# EasyEDA Pro project stm32h7手持mp3.eprj, board PCB1
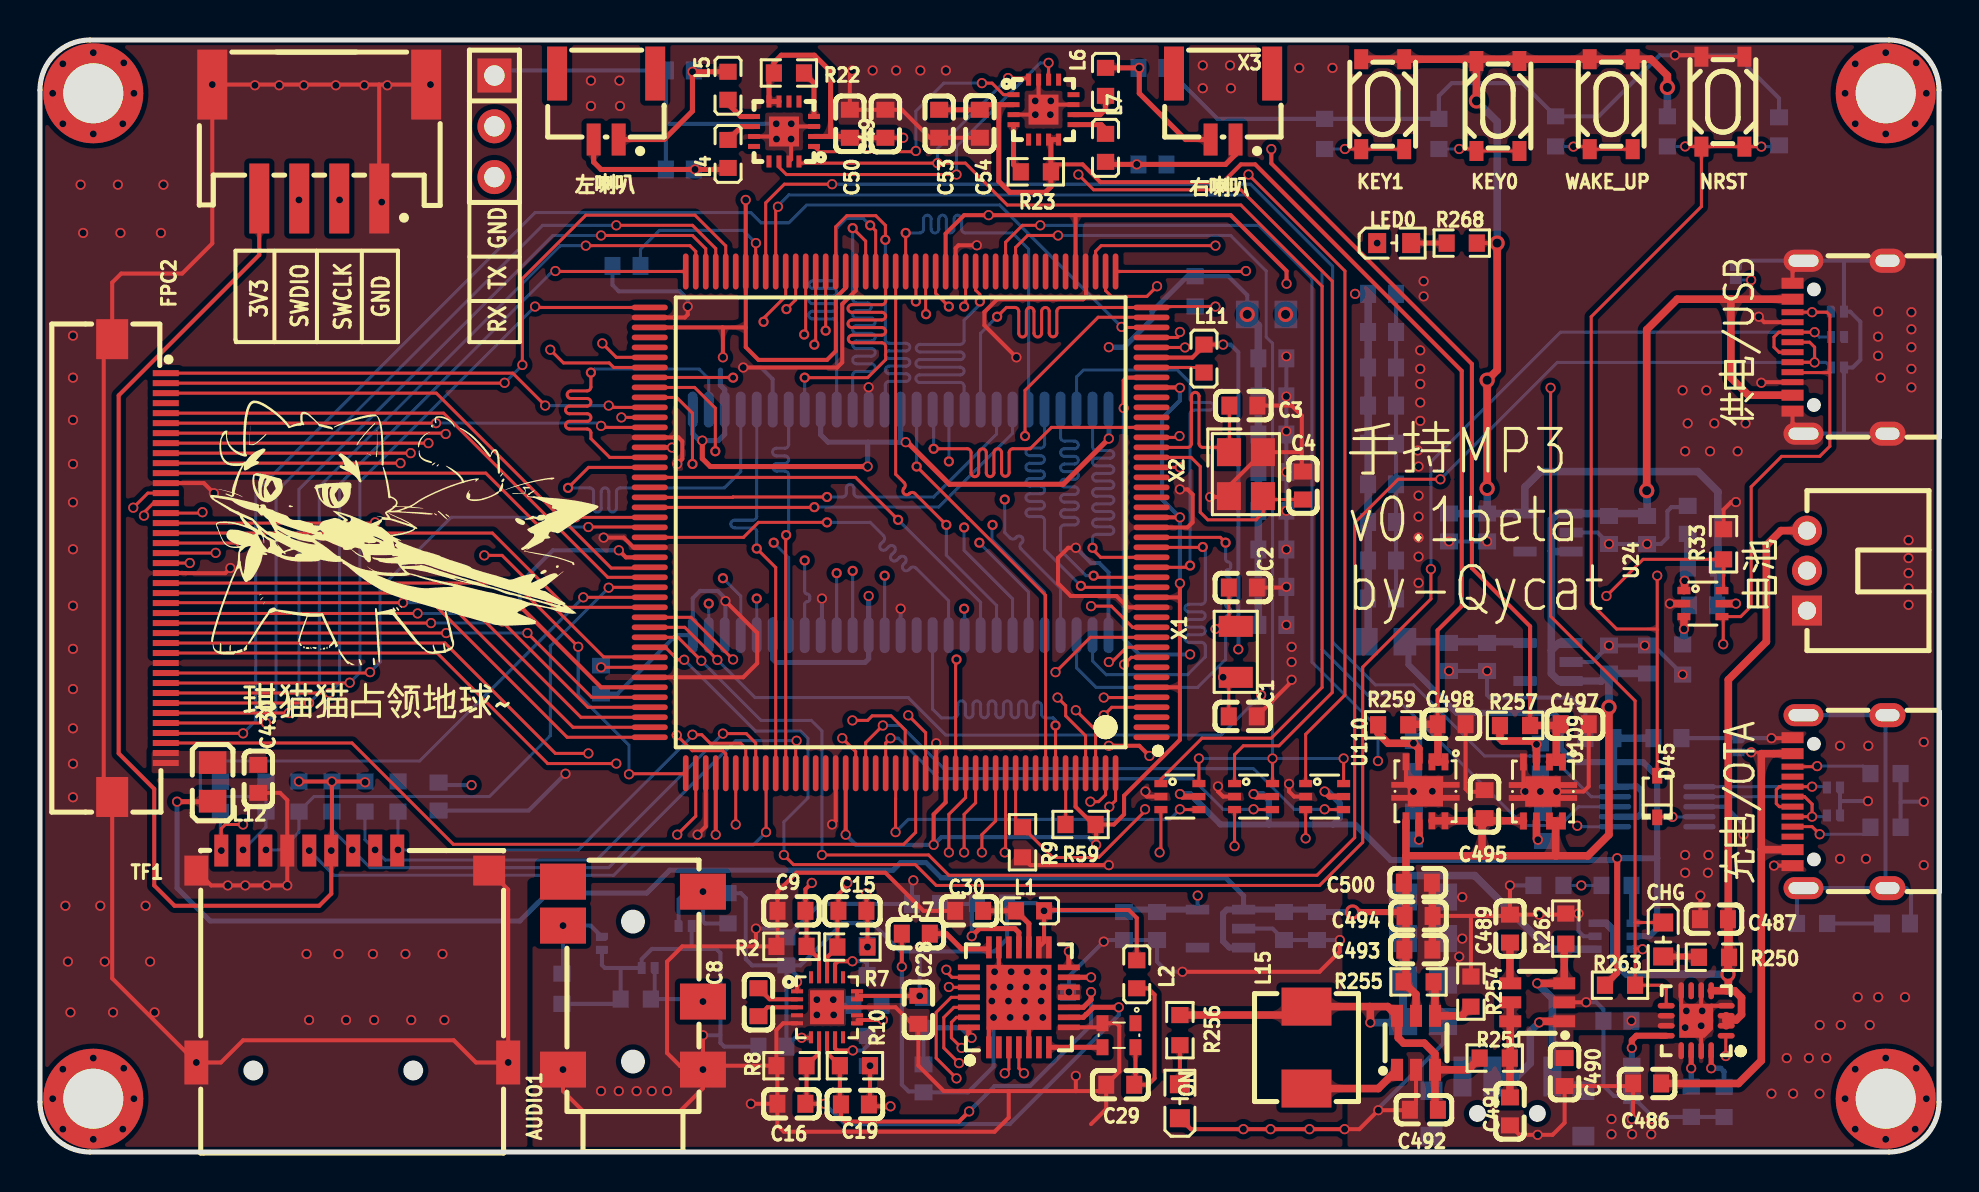
[diagram p2: board, top side]
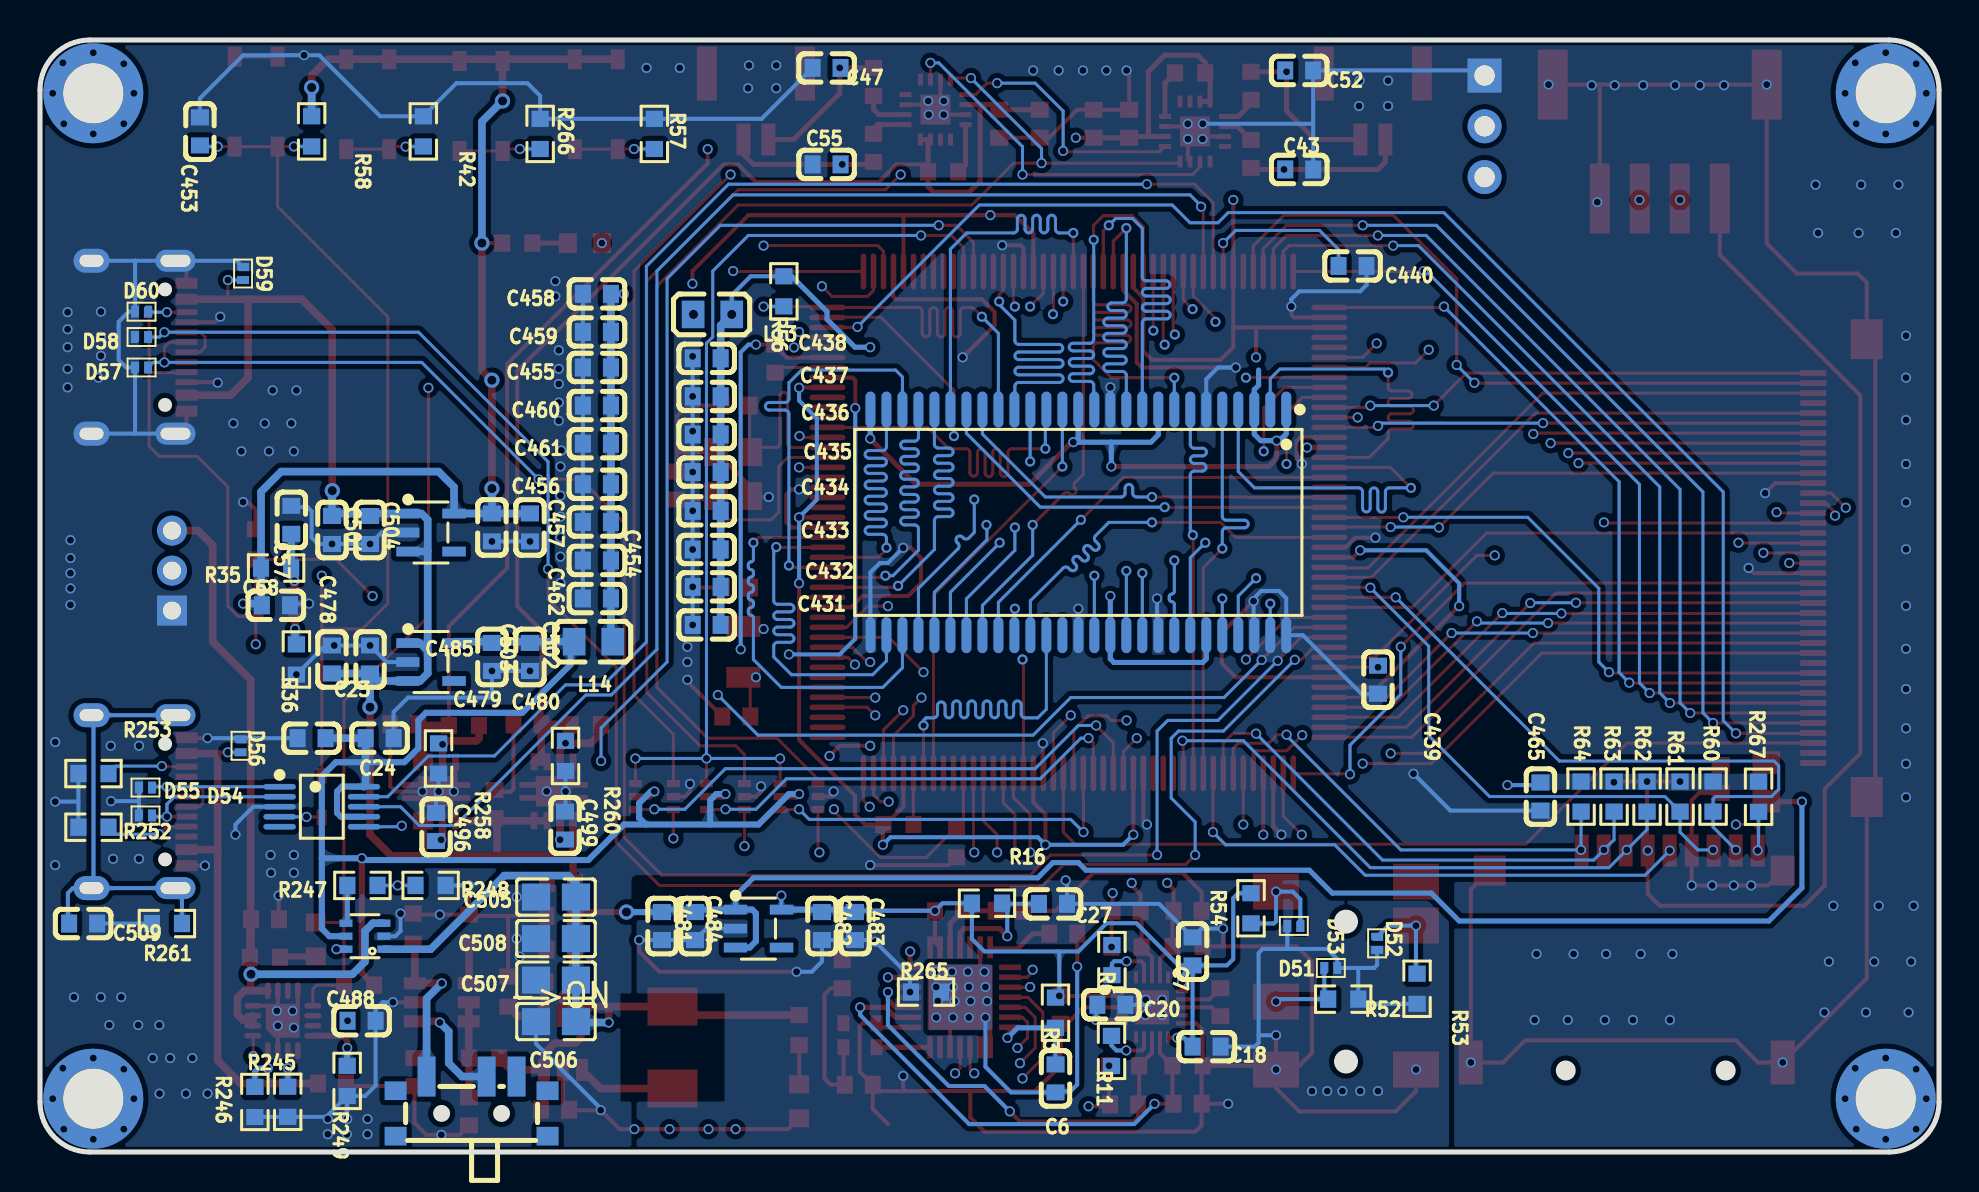
[diagram p3: board, bottom side, seen from below]

Outline 95 x 55.63 mm; copper layers: Top Layer, Inner1, Inner2, Bottom Layer. Coordinates in mm from the lower left corner of the outline.
Outline path: 0,53.13 0,2.5 arc(0.73,0.73) 2.5,0 92.5,0 arc(94.26,0.73) 95,2.5 95,53.13 arc(94.26,54.89) 92.5,55.63 2.5,55.63 arc(0.73,54.89) 0,53.13
Stack: Top Layer 0.035mm 外层铜厚1oz / Dielectric1 0.2104mm 7628 RC49% 8.6mil / Inner1 0.0152mm 内层铜厚 / Dielectric2 1.065mm 1.1mm H/HOZ Copper / Inner2 0.0152mm 内层铜厚 / Dielectric3 0.2104mm 7628 RC49% 8.6mil / Bottom Layer 0.035mm 外层铜厚1oz

## Design rules (mm)
net LCD_RST: LCD
net CTP_INT: LCD
net CTP_SCL: LCD
net LCD_R0: LCD
net LCD_R1: LCD
net LCD_R2: LCD
net LCD_R3: LCD
net LCD_R4: LCD
net LCD_R5: LCD
net LCD_R6: LCD
net LCD_R7: LCD
net LCD_G0: LCD
net LCD_G1: LCD
net LCD_G2: LCD
net LCD_G3: LCD
net LCD_G4: LCD
net LCD_G5: LCD
net LCD_G6: LCD
net LCD_G7: LCD
net LCD_B0: LCD
net LCD_B1: LCD
net LCD_B2: LCD
net LCD_B3: LCD
net LCD_B4: LCD
net LCD_B5: LCD
net LCD_B6: LCD
net LCD_B7: LCD
net LCD_PCLK: LCD
net LCD_HSYNC: LCD
net LCD_VSYNC: LCD
net LCD_DEN: LCD
net BL_CTR: LCD
net RTP_MISO: LCD
net CTP_RST: LCD
net CTP_SDA: LCD
template: 自定义配置
spacing copperThickness1oz (default): track to track 0.102, other pairs 0.152 to 0.3
spacing copperThickness2oz: track to track 0.203, other pairs 0.152 to 0.3
track width copperThickness1oz (default): min 0.127, default 0.254, max 2.54
track width copperThickness2oz: min 0.203, default 0.254, max 2.54
differential pair differentialPair (default): width min 0.127, default 0.254, max 2.54; gap min 0.152, default 0.152
via viaSize (default): diameter min 0.5, default 0.61, max 10; hole min 0.3, default 0.305, max 6.3

## Placement (name value [footprint] x y rotation side)
->ON  MK-12C02-G020  [SW-SMD_MK-12C02-G020]  73.41 2.29 180 bottom
AUDIO1  PJ-3420-A-SMT  [AUDIO-SMD_PJ-3420-A-SMT_C319102]  29.66 8.83 90 top
C1  6pF  [C0603]  60.17 21.79 180 top
C2  6pF  [C0603]  60.17 28.24 180 top
C3  22pF  [C0603]  60.2 37.34 0 top
C4  22pF  [C0603]  63.18 33.34 90 top
C6  1uF  [C0603]  44.2 3.68 90 bottom
C7  100nF  [C0603]  37.34 10.04 90 bottom
C8  4.7uF  [C0603]  35.94 7.49 270 top
C9  2.2nF  [C0603]  37.59 12.06 180 top
C15  2.2nF  [C0603]  40.64 12.06 180 top
C16  2.2nF  [C0603]  37.59 2.41 0 top
C17  2.2uF  [C0603]  43.81 10.92 0 top
C18  100nF  [C0603]  36.64 5.27 0 bottom
C19  2.2nF  [C0603]  40.77 2.38 0 top
C20  22uF  [C0603]  41.4 7.37 180 bottom
C23  0.1uF  [C0603]  81.41 20.7 0 bottom
C24  0.1uF  [C0603]  78.01 20.7 180 bottom
C27  100nF  [C0603]  44.32 12.41 0 bottom
C28  100nF  [C0603]  43.94 7.11 90 top
C29  100nF  [C0603]  54.04 3.37 180 top
C30  100nF  [C0603]  46.48 12.06 0 top
C43  680pF  [C0603]  32 49.15 180 bottom
C47  680pF  [C0603]  55.65 54.23 0 bottom
C49  10uF  [C0603]  40.51 51.43 270 top
C50  100nF  [C0603]  42.29 51.43 90 top
C52  680pF  [C0603]  32.01 54.1 0 bottom
C53  10uF  [C0603]  44.98 51.43 90 top
C54  100nF  [C0603]  47.01 51.43 270 top
C55  680pF  [C0603]  55.65 49.4 180 bottom
C57  100nF  [C0603]  82.42 31.62 90 bottom
C68  100nF  [C0603]  83.2 27.35 0 bottom
C430  100nF  [C0603]  10.92 18.67 270 top
C431  100nF  [C0603]  61.65 26.37 0 bottom
C432  100nF  [C0603]  61.65 28.27 0 bottom
C433  100nF  [C0603]  61.65 30.14 0 bottom
C434  100nF  [C0603]  61.65 32.07 0 bottom
C435  100nF  [C0603]  61.65 34.01 0 bottom
C436  100nF  [C0603]  61.65 35.89 0 bottom
C437  100nF  [C0603]  61.65 37.8 0 bottom
C438  100nF  [C0603]  61.65 39.7 0 bottom
C439  2.2uF  [C0603]  28.06 23.63 90 bottom
C440  2.2uF  [C0603]  29.34 44.32 0 bottom
C453  100nF  [C0603]  87 51.05 90 bottom
C454  100nF  [C0603]  67.14 29.59 180 bottom
C455  100nF  [C0603]  67.14 39.24 180 bottom
C456  100nF  [C0603]  67.14 33.4 180 bottom
C457  100nF  [C0603]  67.14 31.51 180 bottom
C458  100nF  [C0603]  67.14 42.93 180 bottom
C459  100nF  [C0603]  67.14 41.02 180 bottom
C460  100nF  [C0603]  67.14 37.34 180 bottom
C461  100nF  [C0603]  67.14 35.43 180 bottom
C462  10uF  [C0603]  67.14 27.69 180 bottom
C465  100nF  [C0603]  19.94 17.78 270 bottom
C478  100nF  [C0603]  80.39 24.64 270 bottom
C479  100nF  [C0603]  72.39 24.76 90 bottom
C480  10uF  [C0603]  70.48 24.76 90 bottom
C481  100nF  [C0603]  63.88 11.3 90 bottom
C482  100nF  [C0603]  55.88 11.3 90 bottom
C483  10uF  [C0603]  54.23 11.3 90 bottom
C484  10uF  [C0603]  62.23 11.3 90 bottom
C485  10uF  [C0603]  78.49 24.64 270 bottom
C486  1uF  [C0603]  80.39 3.43 180 top
C487  4.7uF  [C0603]  83.74 11.65 0 top
C488  4.7uF  [C0603]  78.91 6.57 0 bottom
C489  1nF  [C0603]  73.53 11.18 270 top
C490  1uF  [C0603]  76.27 4 90 top
C491  100nF  [C0603]  73.53 2.03 270 top
C492  22uF  [C0603]  69.23 2.11 180 top
C493  22uF  [C0603]  68.95 10.12 0 top
C494  22uF  [C0603]  68.96 11.81 0 top
C495  1uF  [C0603]  72.26 17.4 90 top
C496  10nF  [C0603]  75.18 16.26 270 bottom
C497  4.7uF  [C0603]  76.77 21.4 180 top
C498  4.7uF  [C0603]  70.61 21.4 180 top
C499  10nF  [C0603]  68.73 16.33 270 bottom
C500  1uF  [C0603]  68.93 13.47 0 top
C501  100nF  [C0603]  80.39 31.11 90 bottom
C502  100nF  [C0603]  70.48 31.24 90 bottom
C503  10uF  [C0603]  72.39 31.24 90 bottom
C504  10uF  [C0603]  78.49 31.11 90 bottom
C505  22uF  [C0805]  69.18 12.75 180 bottom
C506  22uF  [C0805]  69.18 6.52 180 bottom
C507  22uF  [C0805]  69.18 8.6 180 bottom
C508  22uF  [C0805]  69.18 10.68 180 bottom
C509  4.7nF  [C0603]  92.84 11.43 0 bottom
CHG  GL0603UR01  [LED0603-FD]  81.2 10.63 90 top
D45  1N4148WS  [SOD-323_L1.7-W1.3-LS2.5-FD]  80.9 17.78 270 top
D51  ASB05LCDF  [DFN-2L_L1.0-W0.6-P0.65-BI]  30.43 9.21 180 bottom
D52  ASB05LCDF  [DFN-2L_L1.0-W0.6-P0.65-BI]  28.11 10.44 270 bottom
D53  ASB05LCDF  [DFN-2L_L1.0-W0.6-P0.65-BI]  32.27 11.31 0 bottom
D54  ASB05LCDF  [DFN-2L_L1.0-W0.6-P0.65-BI]  89.72 16.83 180 bottom
D55  ASB05LCDF  [DFN-2L_L1.0-W0.6-P0.65-BI]  89.72 18.23 180 bottom
D56  AZ5825-01F  [DFN-2L_L1.0-W0.6-P0.65-BI]  84.96 20.32 270 bottom
D57  ASB05LCDF  [DFN-2L_L1.0-W0.6-P0.65-BI]  89.92 39.24 180 bottom
D58  ASB05LCDF  [DFN-2L_L1.0-W0.6-P0.65-BI]  89.92 40.77 180 bottom
D59  AZ5825-01F  [DFN-2L_L1.0-W0.6-P0.65-BI]  84.84 43.94 270 bottom
D60  AZ5825-01F  [DFN-2L_L1.0-W0.6-P0.65-BI]  89.92 42.04 0 bottom
FPC2  AFC01-S40FCA-00  [FPC-SMD_AFC01-S40FCA-00]  4.95 29.21 270 top
H1  PZ254V-11-03P  [HDR-TH_3P-P2.54-V-M_PZ254V-11-03P]  22.73 51.31 270 top
KEY0  TS3425BA  [SW-SMD_4P-L4.2-W3.2-P2.15-LS4.6-1]  72.93 52.32 270 top
KEY1  TS3425BA  [SW-SMD_4P-L4.2-W3.2-P2.15-LS4.6-1]  67.17 52.41 270 top
L1  BLM18EG221SN1D  [L0603]  49.53 12.06 0 top
L2  BLM18EG221SN1D  [L0603]  54.86 8.89 90 top
L4  BLM18EG221SN1D  [L0603]  34.42 49.93 270 top
L5  BLM18EG221SN1D  [L0603]  34.42 53.34 90 top
L6  BLM18EG221SN1D  [L0603]  53.3 53.53 90 top
L7  BLM18EG221SN1D  [L0603]  53.3 50.23 270 top
L11  BLM18SG221TN1D  [L0603]  58.23 39.69 90 top
L12  BLM21PG331SN1D  [L0805]  8.64 18.51 90 top
L13  BLM21PG331SN1D  [L0805]  61.36 41.9 180 bottom
L14  BLM21PG331SN1D  [L0805]  67.31 25.53 180 bottom
L15  2.2uH  [IND-SMD_L5.4-W5.2_FXL0530]  63.36 5.22 90 top
LED0  GL0603UR01  [LED0603-FD]  67.74 45.47 180 top
NOREF  -  [Pad_e93]  92.33 52.96 0 top
NOREF#2  -  [Pad_e116]  2.67 2.67 0 top
NOREF#3  -  [Pad_e69]  2.67 52.96 0 top
NOREF#4  -  [Pad_e106]  92.33 2.67 0 top
NRST  TS3425BA  [SW-SMD_4P-L4.2-W3.2-P2.15-LS4.6-1]  84.19 52.54 90 top
ON  GL0603UR01  [LED0603-FD]  57.02 2.54 270 top
OSC1  38.4MHz  [OSC-SMD_4P-L2.0-W1.6-BL_DSB211SDN]  53.98 5.84 180 top
R2  806Ω  [R0603]  37.59 10.29 180 top
R3  3.3kΩ  [R0603]  44.2 6.97 90 bottom
R6  4.7Ω  [R0603]  41.37 9.6 90 bottom
R7  806Ω  [R0603]  40.64 10.25 180 top
R8  806Ω  [R0603]  37.59 4.32 0 top
R9  10K  [R0603]  49.15 15.49 90 top
R10  806Ω  [R0603]  40.77 4.32 0 top
R11  4.7Ω  [R0603]  41.39 5.06 90 bottom
R16  0Ω  [R0603]  47.63 12.45 0 bottom
R22  100kΩ  [R0603]  37.47 53.97 180 top
R23  330kΩ  [R0603]  49.82 49.03 180 top
R33  10kΩ  [R0603]  84.22 30.4 90 top
R35  36kΩ  [R0603]  83.19 29.21 180 bottom
R36  5.1kΩ  [R0603]  82.17 24.64 90 bottom
R42  4.7kΩ  [R0603]  75.82 51.05 270 bottom
R52  5.1kΩ  [R0603]  29.8 7.65 0 bottom
R53  5.1kΩ  [R0603]  26.11 8.17 90 bottom
R54  20kΩ  [R0603]  34.42 12.19 270 bottom
R56  10K  [R0603]  57.79 43.05 90 bottom
R57  4.7kΩ  [R0603]  64.26 50.93 270 bottom
R58  10kΩ  [R0603]  81.41 51.05 90 bottom
R59  10K  [R0603]  52.05 16.38 180 top
R60  10K  [R0603]  11.3 17.78 270 bottom
R61  10K  [R0603]  12.95 17.78 270 bottom
R62  10K  [R0603]  14.61 17.78 270 bottom
R63  10K  [R0603]  16.26 17.78 270 bottom
R64  10K  [R0603]  17.91 17.78 270 bottom
R245  56kΩ  [R0603]  82.6 2.51 90 bottom
R246  2.2kΩ  [R0603]  84.25 2.5 270 bottom
R247  10kΩ  [R0603]  78.87 13.33 0 bottom
R248  10kΩ  [R0603]  75.46 13.33 0 bottom
R249  2.2kΩ  [R0603]  79.63 3.56 90 bottom
R250  1kΩ  [R0603]  83.74 9.74 0 top
R251  0Ω  [R0603]  72.77 4.7 0 top
R252  5.1K  [R0603]  92.32 16.25 0 bottom
R253  5.1K  [R0603]  92.32 18.93 0 bottom
R254  27kΩ  [R0603]  71.58 8.02 90 top
R255  240kΩ  [R0603]  68.96 8.51 180 top
R256  3.3kΩ  [R0603]  57.02 6.1 90 top
R257  22kΩ  [R0603]  73.79 21.34 180 top
R258  4.7kΩ  [R0603]  75.06 19.68 90 bottom
R259  22kΩ  [R0603]  67.69 21.37 180 top
R260  4.7kΩ  [R0603]  68.71 19.81 90 bottom
R261  1M  [R0603]  88.65 11.43 180 bottom
R262  10kΩ  [R0603]  76.33 11.18 270 top
R263  10kΩ  [R0603]  79.04 8.34 0 top
R265  0Ω  [R0603]  50.67 8 0 bottom
R266  4.7kΩ  [R0603]  69.98 50.93 270 bottom
R267  10K  [R0603]  9.03 17.77 270 bottom
R268  3.3kΩ  [R0603]  71.12 45.47 0 top
TF1  TF-CARD H1.8 SY  [TF-SMD_TF-012]  15.62 9.78 0 top
U7  ES9018K2M  [QFN-28_L5.0-W5.0-P0.50-BL-EP3.3]  48.97 7.74 0 top
U8  SABRE9601K  [QFN-20_L3.0-W3.0-P0.40-TL-EP1.7]  39.37 7.24 0 top
U16  MAX98357AETE+T  [TQFN-16_L3.0-W3.0-P0.50-BL-EP1.5]  37.22 51.05 90 top
U17  MAX98357AETE+T  [TQFN-16_L3.0-W3.0-P0.50-BL-EP1.5]  50.2 52.14 270 top
U21  -  [扬声器左]  95 0 0 top
U22  -  [扬声器右]  95 0 90 top
U23  TS5A3159DCKR  [SC-70-6_L2.0-W1.3-P0.65-LS2.1-BL-1]  60.71 17.78 270 top
U24  TS5A3159DCKR  [SC-70-6_L2.0-W1.3-P0.65-LS2.1-BL-1]  83.19 27.43 270 top
U27  TS5A3159DCKR  [SC-70-6_L2.0-W1.3-P0.65-LS2.1-BL-1]  57.02 17.78 270 top
U29  TS5A3159DCKR  [SC-70-6_L2.0-W1.3-P0.65-LS2.1-BL-1]  64.26 17.78 270 top
U97  WAFER-PH2.0-4PWB  [CONN-SMD_4P-P2.00_XUNPU_WAFER-PH2.0-4PWB]  13.97 50.55 180 top
U98  W9825G6KH-6I  [TSOP-54_L22.2-W10.2-P0.80-LS11.8-BL]  43.05 31.5 0 bottom
U99  STM32H743IIT6  [LQFP-176_L24.0-W24.0-P0.50-LS26.0-BL]  43.05 31.5 90 top
U100  CH340X  [MSOP-10_L3.0-W3.0-P0.50-LS5.0-BL]  80.9 17.27 270 bottom
U103  RT9013-33GB  [SOT-23-5_L3.0-W1.7-P0.95-LS2.8-BL]  75.44 24.51 270 bottom
U104  RT9013-33GB  [SOT-23-5_L3.0-W1.7-P0.95-LS2.8-BL]  59.05 11.18 270 bottom
U105  BQ24073RGTR  [QFN-16_L3.0-W3.0-P0.50-TL-EP1.7]  82.85 6.57 180 top
U106  BX-PH2.0-3PWZ  [CONN-TH_3P-P2.00_BX-PH2.0-3PWZ]  88.39 29.08 90 top
U107  TPS22917DBVR  [SOT-23-6_L2.9-W1.6-P0.95-LS2.8-BR]  74.9 7.49 0 top
U108  TLV61070ADBVR  [SOT-23-6_L2.9-W1.6-P0.95-LS2.8-BR]  68.83 5.46 270 top
U109  TPS7A8001DRBR  [VSON-8_L3.0-W3.0-P0.65-TL-EP]  75.18 18.03 270 top
U110  TPS7A8001DRBR  [VSON-8_L3.0-W3.0-P0.65-TL-EP]  69.31 18.04 270 top
U111  RT9013-33GB  [SOT-23-5_L3.0-W1.7-P0.95-LS2.8-BL]  75.44 30.99 270 bottom
U112  TS5A3159DCKR  [SC-70-6_L2.0-W1.3-P0.65-LS2.1-BL-1]  78.74 10.79 90 bottom
USB3  TYPE-C 16PIN 2MD(073)  [USB-C-SMD_TYPE-C-6PIN-2MD-073]  90.04 17.53 90 top
USB4  TYPE-C 16PIN 2MD(073)  [USB-C-SMD_TYPE-C-6PIN-2MD-073]  90.04 40.26 90 top
WAKE_UP  TS3425BA  [SW-SMD_4P-L4.2-W3.2-P2.15-LS4.6-1]  78.6 52.41 270 top
X1  32.768kHz  [OSC-SMD_L3.2-W1.5]  59.82 25.02 270 top
X2  25MHz  [CRYSTAL-SMD_4P-L3.2-W2.5-BL]  60.33 33.91 270 top
X3  GH125-S02DCA-00  [CONN-SMD_2P-P1.25_JUSHUO_GH125-S02DCA-00]  59.18 52.2 180 top
左喇叭  GH125-S02DCA-00  [CONN-SMD_2P-P1.25_JUSHUO_GH125-S02DCA-00]  28.32 52.2 180 top

## Footprints (pads in the part's own frame, mm; a bottom-side part is the same pattern mirrored in y, then rotated)
AUDIO-SMD_PJ-3420-A-SMT_C319102
  rect 1.8x2.3 smd: 1(-4.7,-3.5) 2(-4.7,3.5) 3(-1.3,-3.5) 4(2.5,3.5) 5(4.7,3.5) 6(4.2,-3.5)
C0603
  rect 0.8x0.9 smd: 1(-0.7,0) 2(0.7,0)
C0805
  rect 1.41x1.35 smd: 1(-1,0) 2(1,0)
CONN-SMD_2P-P1.25_JUSHUO_GH125-S02DCA-00
  rect 0.7x1.6 smd: 1(-0.625,1.55) 2(0.625,1.55)
  rect 1x2.7 smd: 3(2.455,-1.75) 4(-2.455,-1.75)
CONN-SMD_4P-P2.00_XUNPU_WAFER-PH2.0-4PWB
  rect 1x3.5 smd: 1(-3,2.85) 2(-1,2.85) 3(1,2.85) 4(3,2.85)
  rect 1.5x3.5 smd: 5(5.35,-2.85) 6(-5.35,-2.85)
CONN-TH_3P-P2.00_BX-PH2.0-3PWZ
  rect 1.5x1.5 hole 0.9: 1(-2,0)
  round 1.5 hole 0.9: 2(0,0) 3(2,0)
CRYSTAL-SMD_4P-L3.2-W2.5-BL
  rect 1.4x1.2 smd: 1(-1.1,-0.85) 2(1.1,-0.85) 3(1.1,0.85) 4(-1.1,0.85)
DFN-2L_L1.0-W0.6-P0.65-BI
  custom 0.41x0.6 smd: 1(-0.325,0)
  rect 0.4x0.6 smd: 2(0.325,0)
FPC-SMD_AFC01-S40FCA-00
  rect 0.3x1.3 smd: 1(-9.75,1.34) 2(-9.25,1.339) 3(-8.75,1.34) 4(-8.25,1.34) 5(-7.75,1.34) 6(-7.25,1.34) 7(-6.75,1.34) 8(-6.25,1.34) 9(-5.75,1.34) 10(-5.25,1.34) 11(-4.75,1.34) 12(-4.25,1.34) 13(-3.75,1.34) 14(-3.25,1.34) 15(-2.75,1.34) 16(-2.25,1.34) 17(-1.75,1.34) 18(-1.25,1.34) 19(-0.75,1.34) 20(-0.25,1.34) 21(0.25,1.34) 22(0.75,1.34) 23(1.25,1.34) 24(1.75,1.34) 25(2.25,1.34) 26(2.75,1.34) 27(3.25,1.34) 28(3.75,1.34) 29(4.25,1.34) 30(4.75,1.34) 31(5.25,1.34) 32(5.75,1.34) 33(6.25,1.34) 34(6.75,1.34) 35(7.25,1.34) 36(7.75,1.34) 37(8.25,1.34) 38(8.75,1.34) 39(9.25,1.34) 40(9.75,1.34)
  rect 2x1.6 smd: 41(-11.45,-1.34) 42(11.45,-1.34)
HDR-TH_3P-P2.54-V-M_PZ254V-11-03P
  rect 1.7x1.7 hole 1.02: 1(-2.54,0)
  round 1.7 hole 1.02: 2(0,0) 3(2.54,0)
IND-SMD_L5.4-W5.2_FXL0530
  rect 1.9x2.5 smd: 1(-2.05,0) 2(2.05,0)
L0603
  rect 0.8x0.864 smd: 1(-0.7,0) 2(0.7,0)
L0805
  rect 1.133x1.377 smd: 1(-0.966,0) 2(0.966,0)
LED0603-FD
  rect 0.9x1 smd: 1(-0.85,0) 2(0.85,0)
LQFP-176_L24.0-W24.0-P0.50-LS26.0-BL
  oval 0.28x1.8 smd: 1(-10.75,-12.55) 2(-10.25,-12.55) 3(-9.75,-12.55) 4(-9.25,-12.55) 5(-8.75,-12.55) 6(-8.25,-12.55) 7(-7.75,-12.55) 8(-7.25,-12.55) 9(-6.75,-12.55) 10(-6.25,-12.55) 11(-5.75,-12.55) 12(-5.25,-12.55) 13(-4.75,-12.55) 14(-4.25,-12.55) 15(-3.75,-12.55) 16(-3.25,-12.55) 17(-2.75,-12.55) 18(-2.25,-12.55) 19(-1.75,-12.55) 20(-1.25,-12.55) 21(-0.75,-12.55) 22(-0.25,-12.55) 23(0.25,-12.55) 24(0.75,-12.55) 25(1.25,-12.55) 26(1.75,-12.55) 27(2.25,-12.55) 28(2.75,-12.55) 29(3.25,-12.55) 30(3.75,-12.55) 31(4.25,-12.55) 32(4.75,-12.55) 33(5.25,-12.55) 34(5.75,-12.55) 35(6.25,-12.55) 36(6.75,-12.55) 37(7.25,-12.55) 38(7.75,-12.55) 39(8.25,-12.55) 40(8.75,-12.55) 41(9.25,-12.55) 42(9.75,-12.55) 43(10.25,-12.55) 44(10.75,-12.55) 89(10.75,12.55) 90(10.25,12.55) 91(9.75,12.55) 92(9.25,12.55) 93(8.75,12.55) 94(8.25,12.55) 95(7.75,12.55) 96(7.25,12.55) 97(6.75,12.55) 98(6.25,12.55) 99(5.75,12.55) 100(5.25,12.55) 101(4.75,12.55) 102(4.25,12.55) 103(3.75,12.55) 104(3.25,12.55) 105(2.75,12.55) 106(2.25,12.55) 107(1.75,12.55) 108(1.25,12.55) 109(0.75,12.55) 110(0.25,12.55) 111(-0.25,12.55) 112(-0.75,12.55) 113(-1.25,12.55) 114(-1.75,12.55) 115(-2.25,12.55) 116(-2.75,12.55) 117(-3.25,12.55) 118(-3.75,12.55) 119(-4.25,12.55) 120(-4.75,12.55) 121(-5.25,12.55) 122(-5.75,12.55) 123(-6.25,12.55) 124(-6.75,12.55) 125(-7.25,12.55) 126(-7.75,12.55) 127(-8.25,12.55) 128(-8.75,12.55) 129(-9.25,12.55) 130(-9.75,12.55) 131(-10.25,12.55) 132(-10.75,12.55)
  oval 1.8x0.28 smd: 45(12.55,-10.75) 46(12.55,-10.25) 47(12.55,-9.75) 48(12.55,-9.25) 49(12.55,-8.75) 50(12.55,-8.25) 51(12.55,-7.75) 52(12.55,-7.25) 53(12.55,-6.75) 54(12.55,-6.25) 55(12.55,-5.75) 56(12.55,-5.25) 57(12.55,-4.75) 58(12.55,-4.25) 59(12.55,-3.75) 60(12.55,-3.25) 61(12.55,-2.75) 62(12.55,-2.25) 63(12.55,-1.75) 64(12.55,-1.25) 65(12.55,-0.75) 66(12.55,-0.25) 67(12.55,0.25) 68(12.55,0.75) 69(12.55,1.25) 70(12.55,1.75) 71(12.55,2.25) 72(12.55,2.75) 73(12.55,3.25) 74(12.55,3.75) 75(12.55,4.25) 76(12.55,4.75) 77(12.55,5.25) 78(12.55,5.75) 79(12.55,6.25) 80(12.55,6.75) 81(12.55,7.25) 82(12.55,7.75) 83(12.55,8.25) 84(12.55,8.75) 85(12.55,9.25) 86(12.55,9.75) 87(12.55,10.25) 88(12.55,10.75) 133(-12.55,10.75) 134(-12.55,10.25) 135(-12.55,9.75) 136(-12.55,9.25) 137(-12.55,8.75) 138(-12.55,8.25) 139(-12.55,7.75) 140(-12.55,7.25) 141(-12.55,6.75) 142(-12.55,6.25) 143(-12.55,5.75) 144(-12.55,5.25) 145(-12.55,4.75) 146(-12.55,4.25) 147(-12.55,3.75) 148(-12.55,3.25) 149(-12.55,2.75) 150(-12.55,2.25) 151(-12.55,1.75) 152(-12.55,1.25) 153(-12.55,0.75) 154(-12.55,0.25) 155(-12.55,-0.25) 156(-12.55,-0.75) 157(-12.55,-1.25) 158(-12.55,-1.75) 159(-12.55,-2.25) 160(-12.55,-2.75) 161(-12.55,-3.25) 162(-12.55,-3.75) 163(-12.55,-4.25) 164(-12.55,-4.75) 165(-12.55,-5.25) 166(-12.55,-5.75) 167(-12.55,-6.25) 168(-12.55,-6.75) 169(-12.55,-7.25) 170(-12.55,-7.75) 171(-12.55,-8.25) 172(-12.55,-8.75) 173(-12.55,-9.25) 174(-12.55,-9.75) 175(-12.55,-10.25) 176(-12.55,-10.75)
MSOP-10_L3.0-W3.0-P0.50-LS5.0-BL
  oval 0.28x1.62 smd: 1(-1,-2.11) 2(-0.5,-2.11) 3(0,-2.11) 4(0.5,-2.11) 5(1,-2.11) 6(1,2.11) 7(0.5,2.11) 8(0,2.11) 9(-0.5,2.11) 10(-1,2.11)
OSC-SMD_4P-L2.0-W1.6-BL_DSB211SDN
  rect 0.6x0.8 smd: 1(-0.825,-0.6) 2(0.825,-0.6) 3(0.825,0.6) 4(-0.825,0.6)
OSC-SMD_L3.2-W1.5
  rect 1.05x1.7 smd: 1(-1.275,0) 2(1.275,0)
Pad_e69
  round 5 hole 3: 1(0,0)
Pad_e93
  round 5 hole 3: 1(0,0)
Pad_e106
  round 5 hole 3: 1(0,0)
Pad_e116
  round 5 hole 3: 1(0,0)
QFN-16_L3.0-W3.0-P0.50-TL-EP1.7
  oval 0.85x0.28 smd: 1(-1.5,0.75) 2(-1.5,0.25) 3(-1.5,-0.25) 4(-1.5,-0.75) 9(1.5,-0.75) 10(1.5,-0.25) 11(1.5,0.25) 12(1.5,0.75)
  oval 0.28x0.85 smd: 5(-0.75,-1.5) 6(-0.25,-1.5) 7(0.25,-1.5) 8(0.75,-1.5) 13(0.75,1.5) 14(0.25,1.5) 15(-0.25,1.5) 16(-0.75,1.5)
  custom 1.7x1.7 smd: 17(0,0)
QFN-20_L3.0-W3.0-P0.40-TL-EP1.7
  rect 0.6x0.2 smd: 1(-1.5,0.8) 2(-1.5,0.401) 3(-1.5,0) 4(-1.5,-0.4) 5(-1.5,-0.8) 11(1.5,-0.8) 12(1.5,-0.4) 13(1.5,0) 14(1.5,0.401) 15(1.5,0.8)
  rect 0.2x0.6 smd: 6(-0.8,-1.5) 7(-0.4,-1.5) 8(0,-1.5) 9(0.4,-1.5) 10(0.799,-1.5) 16(0.8,1.5) 17(0.4,1.5) 18(0,1.5) 19(-0.4,1.5) 20(-0.8,1.5)
  rect 1.7x1.7 smd: 21(0,0)
QFN-28_L5.0-W5.0-P0.50-BL-EP3.3
  rect 0.28x1.1 smd: 1(-1.501,-2.5) 2(-1.001,-2.5) 3(-0.5,-2.5) 4(0,-2.5) 5(0.5,-2.5) 6(1,-2.5) 7(1.501,-2.5) 15(1.501,2.5) 16(1,2.5) 17(0.5,2.5) 18(0,2.5) 19(-0.5,2.5) 20(-1.001,2.5) 21(-1.502,2.5)
  rect 1.1x0.28 smd: 8(2.5,-1.502) 9(2.5,-1.001) 10(2.5,-0.5) 11(2.5,0) 12(2.5,0.5) 13(2.5,1) 14(2.5,1.501) 22(-2.5,1.501) 23(-2.5,1) 24(-2.5,0.5) 25(-2.5,0) 26(-2.5,-0.5) 27(-2.5,-1.001) 28(-2.5,-1.502)
  rect 3.25x3.25 smd: 29(0,0)
R0603
  rect 0.806x0.864 smd: 1(-0.753,0) 2(0.753,0)
SC-70-6_L2.0-W1.3-P0.65-LS2.1-BL-1
  rect 0.364x0.65 smd: 1(-0.65,-0.95) 2(0,-0.95) 3(0.65,-0.95) 4(0.65,0.95) 5(0,0.95) 6(-0.65,0.95)
SOD-323_L1.7-W1.3-LS2.5-FD
  rect 0.78x0.5 smd: 1(-1.04,0) 2(1.04,0)
SOT-23-5_L3.0-W1.7-P0.95-LS2.8-BL
  rect 0.49x1.157 smd: 1(-0.95,-1.153) 2(0,-1.153) 3(0.95,-1.153)
  rect 0.49x1.175 smd: 4(0.95,1.153) 5(-0.95,1.153)
SOT-23-6_L2.9-W1.6-P0.95-LS2.8-BR
  rect 1.1x0.6 smd: 1(1.35,-0.95) 2(1.35,0) 3(1.35,0.95) 4(-1.35,0.95) 5(-1.35,0) 6(-1.35,-0.95)
SW-SMD_4P-L4.2-W3.2-P2.15-LS4.6-1
  rect 1x0.7 smd: 1(-2.25,1.075) 2(2.25,1.075) 3(-2.25,-1.075) 4(2.25,-1.075)
SW-SMD_MK-12C02-G020
  rect 0.9x2 smd: 1(-2.25,1.49) 2(0.75,1.49) 3(2.25,1.49)
  rect 1.1x0.93 smd: 4(3.8,0.779) 5(3.8,-1.49) 6(-3.8,-1.49) 7(-3.8,0.779)
TF-SMD_TF-012
  rect 0.7x1.6 smd: 1(2.25,5.3) 2(1.15,5.3) 3(0.05,5.3) 4(-1.05,5.3) 5(-2.15,5.3) 6(-3.25,5.3) 7(-4.35,5.3) 8(-5.45,5.3) CD(-6.55,5.3)
  rect 1.2x1.5 smd: 10(-7.8,4.3)
  rect 1.2x2.2 smd: 11(-7.8,-5.3) 12(7.8,-5.3)
  rect 1.6x1.5 smd: 13(6.85,4.3)
TQFN-16_L3.0-W3.0-P0.50-BL-EP1.5
  rect 0.25x0.6 smd: 1(-0.749,-1.5) 2(-0.248,-1.5) 3(0.252,-1.5) 4(0.751,-1.5) 9(0.75,1.5) 10(0.25,1.5) 11(-0.25,1.5) 12(-0.749,1.5)
  rect 0.6x0.25 smd: 5(1.5,-0.748) 6(1.5,-0.248) 7(1.5,0.252) 8(1.5,0.752) 13(-1.5,0.752) 14(-1.5,0.252) 15(-1.5,-0.248) 16(-1.5,-0.748)
  rect 1.5x1.5 smd: 17(0,0)
TSOP-54_L22.2-W10.2-P0.80-LS11.8-BL
  oval 0.5x1.8 smd: 1(-10.4,-5.642) 2(-9.6,-5.642) 3(-8.8,-5.642) 4(-8,-5.642) 5(-7.2,-5.642) 6(-6.4,-5.642) 7(-5.6,-5.642) 8(-4.8,-5.642) 9(-4,-5.642) 10(-3.2,-5.642) 11(-2.4,-5.642) 12(-1.6,-5.642) 13(-0.8,-5.642) 14(0,-5.642) 15(0.8,-5.642) 16(1.6,-5.642) 17(2.4,-5.642) 18(3.2,-5.642) 19(4,-5.642) 20(4.8,-5.642) 21(5.6,-5.642) 22(6.4,-5.642) 23(7.2,-5.642) 24(8,-5.642) 25(8.8,-5.642) 26(9.6,-5.642) 27(10.4,-5.642) 28(10.4,5.642) 29(9.6,5.642) 30(8.8,5.642) 31(8,5.642) 32(7.2,5.642) 33(6.4,5.642) 34(5.6,5.642) 35(4.8,5.642) 36(4,5.642) 37(3.2,5.642) 38(2.4,5.642) 39(1.6,5.642) 40(0.8,5.642) 41(0,5.642) 42(-0.8,5.642) 43(-1.6,5.642) 44(-2.4,5.642) 45(-3.2,5.642) 46(-4,5.642) 47(-4.8,5.642) 48(-5.6,5.642) 49(-6.4,5.642) 50(-7.2,5.642) 51(-8,5.642) 52(-8.8,5.642) 53(-9.6,5.642) 54(-10.4,5.642)
USB-C-SMD_TYPE-C-6PIN-2MD-073
  rect 0.55x1.1 smd: 1(-3.2,2.375) 2(-2.4,2.375) 11(2.4,2.375) 12(3.2,2.375)
  rect 0.3x1.1 smd: 3(-1.75,2.375) 4(-1.25,2.375) 5(-0.75,2.375) 6(-0.25,2.375) 7(0.25,2.375) 8(0.75,2.375) 9(1.25,2.375) 10(1.75,2.375)
  oval 1.1x2 hole 0.6x1.5: 13(-4.325,1.825) 14(4.325,1.825)
  oval 1.2x1.8 hole 0.6x1.2: 13(-4.325,-2.375) 14(4.325,-2.375)
VSON-8_L3.0-W3.0-P0.65-TL-EP
  rect 0.85x0.34 smd: 1(-1.476,0.975) 2(-1.476,0.325) 3(-1.476,-0.325) 4(-1.476,-0.976) 5(1.476,-0.976) 6(1.476,-0.325) 7(1.476,0.325) 8(1.476,0.976)
  custom 1.52x3.42 smd: 9(0,-0.005)

## Nets
As in the schematic, except:
GND: C1.1 C2.1 C3.2 C4.2 C6.1 C17.1 C23.2 C24.2 C43.2 C47.2 C49.1 C50.2 C52.1 C53.1 C54.2 C55.1 C57.2 C68.1 C430.2 C431.2 C432.2 C433.2 C434.2 C435.2 C436.2 C437.2 C438.2 C439.1 C440.1 C453.2 C454.1 C455.1 C456.1 C457.1 C458.1 C459.1 C460.1 C461.1 C462.1 C465.2 C478.1 C479.1 C480.1 C485.1 C486.2 C487.1 C488.1 C489.1 C490.1 C491.2 C492.2 C493.2 C494.2 C495.2 C496.1 C497.1 C498.1 C499.1 C500.2 C501.1 C502.1 C503.1 C504.1 C505.1 C506.1 C507.1 C508.1 C509.1 D54.1 D55.1 D56.1 D57.1 D58.1 D59.1 D60.2 FPC2.12 FPC2.21 FPC2.30 FPC2.41 FPC2.42 H1.1 NRST.2 NRST.4 ON.2 R9.1 R33.2 R36.1 R42.1 R57.1 R245.1 R246.2 R248.1 R249.1 R252.2 R253.2 R254.2 R258.1 R260.1 R261.1 R262.1 R265.1 R266.1 TF1.6 TF1.10 TF1.11 TF1.12 TF1.13 U7.1 U7.5 U7.20 U7.29 U16.3 U16.11 U16.15 U16.17 U17.3 U17.11 U17.15 U17.17 U23.2 U24.2 U27.2 U29.2 U97.1 U97.5 U97.6 U98.6 U98.12 U98.28 U98.41 U98.46 U98.52 U98.54 U99.14 U99.22 U99.48 U99.61 U99.71 U99.90 U99.102 U99.113 U99.126 U99.135 U99.148 U99.158 U100.3 U103.2 U105.4 U105.6 U105.8 U105.15 U105.17 U106.1 U107.2 U108.2 U109.4 U109.9 U110.4 U110.9 U111.2 U112.2 USB3.1 USB3.12 USB4.1 USB4.3 USB4.9 USB4.12 USB4.13 USB4.14 X2.2 X2.4
VCC3V3: C23.1 C24.1 C465.1 C479.2 C480.2 L14.1 R60.1 R61.1 R62.1 R63.1 R64.1 R263.1 R267.1 TF1.4 U23.5 U27.5 U29.5 U97.4 U100.7 U100.10 U103.5 U112.5
CHG: CHG.2 R263.2 U99.47 U105.9 U112.6
KEY0: KEY0.2 KEY0.4 R266.2 U99.41
KEY1: KEY1.2 KEY1.4 R57.2 U99.46
LED0: LED0.2 U99.45
NRST: C453.1 D45.1 NRST.1 NRST.3 R58.1 U99.31
SDIO_CD: R267.2 TF1.CD U99.138
SDIO_CLK: TF1.5 U99.141
SDIO_CMD: R62.2 TF1.3 U99.144
SDIO_D0: R61.2 TF1.7 U99.117
SDIO_D1: R60.2 TF1.8 U99.118
SDIO_D2: R64.2 TF1.1 U99.139
SDIO_D3: R63.2 TF1.2 U99.140
VOUT-A: ->ON.2 C488.2 C490.2 U105.10 U105.11 U107.1
VP3V3: C68.2 C502.2 C503.2 KEY0.1 KEY0.3 KEY1.1 KEY1.3 L13.1 R35.1 R58.2 R268.2 U24.5 U111.5 WAKE_UP.1 WAKE_UP.3
WAKE_UP: R42.2 U99.40 WAKE_UP.2 WAKE_UP.4
$1N20891: C52.2 L5.2 左喇叭.1
$1N20892: C43.1 L4.2 左喇叭.2
$1N28936: CHG.1 R250.1
$1N28944: ->ON.1 R262.2 U107.3
$1N41036: ON.1 R256.1
$1N86901: LED0.1 R268.1

Pads without a net: ->ON 3 4 5 6 7; AUDIO1 5; NOREF 1; NOREF#2 1; NOREF#3 1; NOREF#4 1; OSC1 1; U7 2 6 19 22; U8 10 16 20; U16 5 6 12 13; U17 5 6 12 13; U98 40; U100 5; U103 4; U104 4; U105 7; U111 4; USB3 3 9; X3 3 4; 左喇叭 3 4

## Via types
v1: diameter 0.508, hole 0.35, Top Layer to Bottom Layer, 529 vias
v2: diameter 0.762, hole 0.457, Top Layer to Bottom Layer, 11 vias
v3: diameter 0.508, hole 0.305, Top Layer to Bottom Layer, 53 vias

## Routing (per net, layer and track width the routed paths; a pad name or vN(x,y) marks a point on that pad's centre or on a via; arc(x,y) is an arc through that point)
AGND: length 186.2
  Top Layer w0.203: C29.2 53.99,4.02 53.99,6.3 53.85,6.44 53.15,6.44 52.94,6.24 U7.8 ; C29.2 53.02,3.05 51.82,3.05 ; C29.2 53.34,2.16 52.58,1.4 ; v1(35.81,11.18) 35.81,10.29 35.81,10.29 ; R8.1 36.89,4.27 C16.1 ; R8.1 33.36,4.32 v1(33.16,4.13) ; R8.1 36.84,6.1 37.17,6.44 U8.5 ; 45.78,12.06 44.2,12.06 42.29,13.97 37.85,13.97 36.89,13.02 C9.2 36.89,10.34 R2.2 35.81,10.29 ; v1(33.16,4.13) 33.16,3.19 32,2.03 27.18,2.03 26.16,3.05 AUDIO1.2 ; v1(33.16,4.13) v1(33.16,5.84) ; v1(33.16,4.13) 32.99,4.3 32.02,4.3 31.37,4.95 31.37,9.52 32.13,10.29 35.81,10.29 ; C16.1 36.89,1.34 37.21,1.02 47.75,1.02 48.46,1.72 48.46,3.05 ; C16.1 v1(35.56,2.41) ; U8.21 U8.13 42.8,7.24 43.63,6.41 43.94,6.41 43.94,4.32 45.21,3.05 48.46,3.05 ; 48.46,3.05 51.82,3.05 ; 51.82,3.05 v1(51.82,3.81) ; U99.37 55.59,38.73 54.36,38.73 54.21,38.59 v1(54.21,37.21) ; v1(57.15,9.02) 64.01,9.02 65.02,10.03 v1(65.02,10.6)
  Inner2 w0.203: v1(51.82,3.81) 51.82,7.66 v1(51.47,8) ; v1(57.53,24.89) 59.05,24.89 59.82,24.13 59.82,23.37 59.07,22.62 55.38,22.62 54.21,21.45 54.21,10.67 54.07,10.52 v1(53.21,10.52)
  Bottom Layer w0.203: 34.04,5.84 34.04,5.46 34.23,5.27 C18.1 ; 34.04,5.84 v1(33.16,5.84) ; 34.04,5.84 34.04,9.96 33.83,10.16 32.6,10.16 ; 32.6,11.31 32.6,10.16 ; 32.6,10.16 30.61,10.16 30.1,9.65 D51.2 29.02,9.21 ; 29.02,9.21 28.26,9.21 28.11,9.36 D52.2 ; 29.02,9.21 29.05,9.18 R52.1 28.81,7.41 R53.1 ; v1(43.69,13.59) 43.62,13.52 C27.1 39.02,12.41 C7.2 36.9,11.18 v1(35.81,11.18) ; v1(57.53,24.89) 54.99,24.89 54.21,25.67 v1(54.21,37.21) ; v1(51.47,8) 51.47,8.78 v1(53.21,10.52) 53.29,10.6 C483.1 C482.1 55.88,9.52 56.39,9.02 v1(57.15,9.02) ; v1(65.02,10.6) C481.1 C484.1 61.66,11.18 U104.2 ; C20.2 39.5,7.37
  vias: v1(26.16,4.13) v1(28.07,3.05) v1(28.95,3.05) v1(29.84,3.05) v1(30.61,3.05) v1(31.37,3.05) v1(38.86,7.62) v1(38.86,6.86) v1(39.68,7.62) v1(39.7,6.86)
GND: length 604.3
  Top Layer w0.203: C495.2 72.18,18.02 71.46,18.02 71.31,18.16 C498.1 ; USB3.12 87.64,20.7 v1(86.61,20.7) ; v1(55.3,18.03) 55.3,17.85 55.37,17.78 U27.2 ; v1(40.64,54.1) 40.51,53.97 C49.1 C50.2 43.11,52.13 44.52,50.73 C53.1 C54.2 ; U16.17 37.22,51.03 v1(37.57,50.67) 37.57,49.65 U16.15 ; U16.17 37.22,51.07 v1(37.58,51.43) 37.72,51.3 U16.3 ; U16.17 v1(36.84,50.67) 36.83,50.67 36.7,50.8 U16.11 ; C494.2 71.55,11.81 ; 71.55,11.81 71.58,11.79 R254.2 ; 71.55,11.81 73.47,11.81 C489.1 ; v1(31.88,34.42) 32.13,34.67 32.13,35.55 31.94,35.75 U99.102 ; U7.29 47.47,6.24 U7.1 ; U7.29 47.97,8.74 U7.20 ; U7.29 49.47,7.24 U7.5 ; v1(32.89,15.87) 33.3,16.28 U99.135 ; U105.4 83.6,7.32 83.1,6.82 U105.6 ; v1(51.82,30.23) 51.44,30.23 50.93,29.72 50.93,28.45 51.56,27.81 53.85,27.81 54.42,27.25 U99.14 ; C491.2 74.01,0.86 v1(74.92,0.86) 75.66,0.86 76.27,1.46 C490.1 79.56,3.3 C486.2 79.69,1.72 v1(79.63,1.65) ; R33.2 84.22,32.13 84.6,32.51 v1(84.84,32.51) ; U109.4 74.21,18.12 v1(74.3,18.03) ; v1(39.62,16.38) 39.8,16.56 U99.148 ; USB4.3 86.13,38.51 v1(86.11,38.48) ; v1(81.79,54.86) 83.04,54.86 NRST.2 NRST.4 ; C2.1 62.31,28.24 v1(62.35,28.27) ; v1(8.7,32.96) 8.2,33.46 FPC2.12 ; v1(46.86,45.36) 45.95,45.36 45.8,45.21 U99.61 ; C489.1 v1(73.53,13.33) ; C489.1 v1(75,11.88) 76.27,11.88 R262.1 v1(76.96,11.93) ; U99.126 35.18,23.75 35.88,24.45 35.88,25.97 v1(34.29,27.56) ; USB4.9 86.25,41.51 v1(85.98,41.78) ; FPC2.21 7.28,28.96 7.28,28.96 9.27,28.96 v1(9.53,29.21) ; U107.2 77.34,7.49 v1(77.34,7.49) ; U29.2 62.74,17.78 62.48,18.03 v1(62.48,18.41) ; U99.113 29.69,30.25 29.2,30.73 v1(28.19,30.73) ; v1(49.78,52.58) 49.95,52.75 U17.15 ; U17.3 49.95,51.89 U17.17 50.45,52.39 U17.11 ; ON.2 57.57,1.14 v1(60.2,1.14) v1(61.56,1.14) v1(63.51,1.14) v1(65.26,1.14) 66,1.14 v1(66.95,2.09) 68.51,2.09 C492.2 68.83,2.42 U108.2 ; C497.1 77.47,18.29 77.22,18.03 v1(75.86,18.03) ; U97.1 16.97,53.39 16.96,53.4 ; v1(58.93,18.29) 58.93,18.03 59.18,17.78 U23.2 ; U99.90 32.26,41.75 32.4,41.89 v1(32.4,42.29) ; v1(68.71,18.03) 68.33,18.41 U110.4 ; 63.12,35.01 63.12,36.83 62.61,37.34 C3.2 ; 63.12,35.01 X2.4 59.48,33.31 X2.2 59.43,32.77 v1(58.54,32.77) ; 63.12,35.01 63.12,34.1 C4.2 ; 16.96,53.4 v1(8.62,53.4) 8.62,45.45 7.11,43.94 4.06,43.94 3.61,43.49 FPC2.41 3.19,40.23 3.19,18.19 3.61,17.76 3.61,8.69 v1(7.82,4.48) 9.05,4.48 10.16,5.59 20.7,5.59 21.81,4.48 v1(23.42,4.48) 23.42,13.13 TF1.13 ; 16.96,53.4 19.32,53.4 ; R9.1 49.54,14.35 v1(53.47,14.35) ; U99.22 55.61,31.24 57.4,31.24 57.66,31.5 57.66,32.89 57.4,33.15 v1(57.02,33.15) ; C430.2 12.01,17.97 12.37,17.6 TF1.6 v1(12.37,13.33) v1(11.35,13.33) v1(10.27,13.33) v1(9.4,13.33) 8.56,13.33 TF1.10 ; U99.158 44.83,18.97 v1(44.83,20.45) ; U105.15 v1(83.1,6.32) U105.17 v1(82.36,7.06) 82.1,7.32 U105.8 ; 83.04,11.65 83.06,11.67 v1(83.06,12.83) ; C1.1 62.61,23.53 v1(62.61,23.62) ; USB4.1 87.67,36.48 USB4.13 ; v1(48.84,39.75) 47.24,41.35 47.24,42.02 47.88,42.66 52.18,42.66 52.32,42.8 52.32,44.02 U99.48 ; USB4.12 87.67,44.03 USB4.14 ; U99.71 40.8,43.09 40.13,42.42 40.13,39.5 39.88,39.24 v1(35.18,39.24) ; USB3.1 v1(86.74,14.33) ; C17.1 v1(43.11,9.27)
  Top Layer w0.381: C493.2 69.65,13.45 C500.2 ; U24.2 v1(81.53,27.43)
  Inner1 w0.203: 36.19,38.23 36.21,38.21 36.21,37.61 36.07,37.46 32.89,37.46 32.39,36.96 32.39,34.92 v1(31.88,34.42) ; 36.19,38.23 38.46,38.23 38.49,38.25 v1(41.45,38.25) 46.12,38.25 ; 36.19,38.23 35.75,38.23 35.18,38.8 v1(35.18,39.24) 35.18,40.89 33.78,42.29 v1(32.4,42.29) ; v1(34.29,27.56) 35.31,28.57 38.23,28.57 v1(39.12,27.69) 39.62,27.18 v1(43.05,27.18) 44.83,27.18 ; 46.12,38.25 47.35,38.25 v1(48.84,39.75) ; 46.12,38.25 46.12,37.32 51.82,31.62 v1(51.82,30.23) 49.28,27.69 45.72,27.69 45.21,27.18 44.83,27.18 ; 44.83,27.18 v1(44.83,20.45) ; v1(85.98,41.78) 85.98,38.61 v1(86.11,38.48) ; v1(50.22,9.02) 50.22,9.96 53.47,13.21 v1(53.47,14.35)
  Inner2 w0.203: v1(77.34,7.49) 76.96,7.87 v1(76.96,11.93)
  Bottom Layer w0.203: R246.2 84.24,1.76 R245.1 80.67,1.76 R249.1 ; R249.1 79.63,1.65 v1(79.63,1.65) ; R249.1 78.73,2.8 78.21,3.32 C488.1 78.21,7.13 77.85,7.49 v1(77.34,7.49) ; C23.2 84.91,20.7 D56.1 85.02,20.7 v1(86.61,20.7) ; v1(62.35,26.37) v1(62.35,28.27) v1(62.35,30.14) v1(62.35,32.07) v1(62.35,34.01) v1(62.35,36.06) v1(62.35,37.8) v1(62.35,39.8) ; D55.1 90.04,17.55 ; 90.04,17.55 v1(91.44,17.55) ; 90.04,17.55 D54.1 ; 93.07,17.49 93.11,17.53 v1(94.23,17.53) ; 93.07,17.49 R253.2 ; 93.07,17.49 R252.2 ; 90.24,44.58 USB4.14 85.15,44.58 D59.1 ; 90.24,44.58 USB4.14 ; 90.24,44.58 D60.2 90.55,42.04 91.06,41.53 91.06,39.62 90.68,39.24 D57.1 90.24,35.93 ; C499.1 68.71,17.06 v1(68.71,18.03) R260.1 ; v1(26.29,18.92) 24.45,17.08 C465.2 ; U98.41 v1(43.05,27.18) ; C24.2 77.31,22.01 76.58,22.73 72.52,22.73 72.39,22.86 v1(72.39,24.06) v1(70.48,24.06) ; v1(35.18,39.24) 36.07,39.24 36.65,38.66 U98.6 ; C57.2 82.36,32.26 81.61,32.26 81.41,32.05 81.41,30.73 81.09,30.41 v1(80.39,30.41) v1(78.49,30.41) 77.91,30.99 U111.2 ; v1(51.82,30.23) 52.58,29.46 52.98,29.46 53.45,29 U98.28 ; 31.31,51.43 C52.1 22.99,54.1 H1.1 ; 31.31,51.43 31.31,49.15 C43.2 ; 31.31,51.43 v1(36.83,51.43) ; C458.1 C459.1 C455.1 C460.1 C461.1 C456.1 C457.1 C454.1 C462.1 ; v1(82.17,23.88) 80.72,25.34 v1(80.28,25.34) v1(78.49,25.34) 77.66,24.51 U103.2 ; v1(72.39,30.54) v1(70.48,30.54) ; C496.1 75.18,17.9 v1(75.05,18.03) 75.06,18.04 R258.1 ; v1(47.7,6.73) 47.7,4.27 46.42,2.98 C6.1 44.15,3.03 43.45,3.03 43.11,3.37 v1(43.11,9.27) ; v1(85.22,15.87) 85.22,16.38 84.33,17.27 U100.3 ; v1(66.95,2.09) 66.95,2.18 70.18,5.41 C506.1 ; U112.2 77.22,10.79 76.96,11.05 v1(76.96,11.93) ; C68.1 82.41,27.43 v1(81.53,27.43) ; C453.2 87,52.7 84.84,54.86 v1(81.79,54.86) 81.03,54.86 77.97,51.81 R42.1 74.16,53.47 70.61,53.47 69.98,52.83 R266.1 R57.1 58.9,51.68 C47.2 ; U98.46 39.12,25.92 v1(39.12,27.69) ; U98.12 v1(41.45,38.25) ; USB4.13 90.24,35.93 ; 90.24,35.93 USB4.13 ; C440.1 28.64,43.37 28.96,43.05 32,43.05 32.4,42.66 v1(32.4,42.29) ; R261.1 C509.1 ; R248.1 v1(73.53,13.33) ; C439.1 28.89,22.93 31.82,25.85 U98.54 32.65,27.7 33.02,28.07 33.91,28.07 34.29,27.69 v1(34.29,27.56) 34.29,25.89 U98.52
  vias: v1(1.27,12.32) v1(1.4,9.52) v1(1.52,6.98) v1(1.65,40.83) v1(1.65,38.73) v1(1.65,36.62) v1(1.65,34.42) v1(1.65,32.5) v1(1.65,30.15) v1(1.65,27.33) v1(1.65,25.17) v1(1.65,23.16) v1(1.65,21.19) v1(1.65,19.42) v1(1.65,17.74) v1(2.03,48.39) v1(2.16,45.97) v1(3.02,12.32) v1(3.24,9.52) v1(3.66,6.98) v1(3.9,48.39) v1(4.03,45.97) v1(5.28,12.32) v1(5.51,9.52) v1(5.73,6.98) v1(6.05,45.97) v1(6.18,48.39) v1(10.75,53.36) v1(11.97,53.36) v1(13.2,53.36) v1(13.34,9.91) v1(13.46,6.6) v1(14.8,53.36) v1(14.93,9.91) v1(15.31,6.6) v1(16.23,53.36) v1(16.65,9.91) v1(16.72,6.6) v1(17.09,47.52) v1(17.37,53.36) v1(18.28,9.91) v1(18.57,6.6) v1(19.53,53.4) v1(20.14,9.91) v1(20.23,6.6) v1(27.56,53.59) v1(27.56,52.32) v1(28.99,53.59) v1(29.01,52.32) v1(41.65,54.1) v1(42.82,54.1) v1(44.04,54.1) v1(45.32,54.1) v1(47.62,7.55) v1(47.7,8.25) v1(47.75,9.02) v1(48.45,7.55) v1(48.58,9.02) v1(48.53,8.25) v1(48.53,6.73) v1(49.24,7.55) v1(49.38,9.02) v1(49.33,8.25) v1(49.33,6.73) v1(49.79,51.89) v1(50.08,7.55) v1(50.17,8.25) v1(50.17,6.73) v1(50.56,52.58) v1(50.54,51.89) v1(58.17,54.36) v1(58.17,53.21) v1(59.53,54.36) v1(59.57,53.21) v1(62.61,25.27) v1(62.61,24.51) v1(62.99,54.23) v1(64.66,54.23) v1(68.92,35.09) v1(68.96,34.29) v1(68.96,32.84) v1(68.96,31.78) v1(68.96,30.74) v1(68.96,29.78) v1(68.96,28.47) v1(69.05,40.1) v1(69.05,39.18) v1(69.05,38.42) v1(69.05,37.49) v1(69.05,36.57) v1(69.22,43.56) v1(69.22,42.8) v1(69.65,18.04) v1(71,9.77) v1(71.15,12.75) v1(71.15,10.68) v1(78.61,1.65) v1(78.61,0.89) v1(79.64,0.89) v1(80.6,1.65) v1(80.6,0.89) v1(82.17,38.1) v1(82.3,35.05) v1(82.3,14.86) v1(82.3,13.97) v1(82.3,6.22) v1(82.42,36.45) v1(83.15,7.06) v1(83.36,38.1) v1(83.46,14.86) v1(83.44,13.97) v1(83.54,35.05) v1(83.75,36.45) v1(84.92,35.05) v1(85.32,36.45) v1(86.61,2.92) v1(87.38,4.7) v1(87.7,2.92) v1(88.48,4.7) v1(89.02,2.92) v1(89.03,6.35) v1(89.36,4.7) v1(90.04,20.32) v1(90.04,14.66) v1(90.08,6.35) v1(90.93,7.75) v1(91.34,14.66) v1(91.46,20.32) v1(91.53,6.35) v1(91.95,42.04) v1(91.95,40.78) v1(91.95,39.83) v1(91.95,7.75) v1(92.08,38.73) v1(93.3,7.75) v1(93.47,30.61) v1(93.47,29.71) v1(93.47,28.96) v1(93.47,28.19) v1(93.47,27.37) v1(93.61,42.01) v1(93.61,41.15) v1(93.61,40.26) v1(93.61,39.17) v1(93.61,38.25) v1(94.23,20.51) v1(94.23,14.35)
V4.5L: length 70.6
  Top Layer w0.203: v1(61.6,50.16) 61.6,49.45 71.63,39.42 71.63,29.21 74.54,26.3 R257.1 ; 42.42,50.73 v1(43.18,50.73)
  Top Layer w0.254: 39.56,50.8 39.55,50.81 39.55,54.05 38.73,54.86 37.08,54.86 36.71,54.49 R22.2 36.47,53.73 U16.8 U16.7 ; 39.56,50.8 40.45,50.8 C49.2 42.42,50.73 ; 39.56,50.8 U16.2
  Top Layer w0.381: U109.2 75.85,19.51 ; 75.85,19.51 75.85,21.18 76.01,21.34 ; 75.85,19.51 U109.1 ; 76.01,21.34 C497.2 ; 76.01,21.34 R257.1
  Inner2 w0.203: v1(61.6,50.16) 61.02,50.73 v1(43.18,50.73)
V4.5R: length 61.3
  Top Layer w0.203: 50.57,49.4 52.15,49.4 53.04,48.51 59.18,48.51 60.07,49.4 60.79,49.4 71.12,39.07 71.12,27.3 69.91,26.1 C498.2
  Top Layer w0.254: C53.2 C54.1 47.27,52.39 47.96,52.39 ; 47.96,52.39 47.96,48.56 48.51,48.01 50.29,48.01 50.57,48.28 R23.1 50.57,50.53 U17.7 U17.8 ; 47.96,52.39 U17.2
  Top Layer w0.381: 69.93,19.52 U110.2 ; 69.93,19.52 69.93,21.38 C498.2 68.47,21.4 R259.1 ; 69.93,19.52 U110.1
VBAT: length 42.7
  Top Layer w0.381: U105.3 U105.2 ; 84.35,6.6 84.85,6.6 85.12,6.87 85.12,7.72 84.77,8.07 84.39,8.07 ; 84.45,11.63 84.49,11.59 R250.2 84.45,9.71 ; 84.45,11.63 84.45,9.71 ; 84.45,11.63 C487.2 v2(84.44,8.89) ; 84.45,11.63 84.45,23.62 86.36,25.53 86.36,30.35 87.09,31.08 U106.3 ; 84.45,9.71 84.45,8.13 84.39,8.07 ; 84.39,8.07 U105.5
  Bottom Layer w0.381: v2(84.44,8.89) 79.37,8.89 78.74,9.52 78.74,11.05 78.34,11.44 U112.3
VBATADC: length 1.9
  Bottom Layer w0.254: R247.2 79.62,11.51 U112.4
VBUS-A: length 25.8
  Top Layer w0.152: 86.72,19.93 86.65,19.99 v1(85.6,19.99)
  Top Layer w0.381: USB3.11 86.11,19.93 86.11,15.13 ; 86.11,15.13 86.11,4.57 84.96,3.43 C486.1 ; 86.11,15.13 USB3.2
  Bottom Layer w0.152: D56.2 v1(85.6,19.99)
VCC3V3: length 175.1
  Top Layer w0.203: v1(14.61,18.53) 16.22,18.53 v1(16.26,18.49) ; v1(14.61,18.53) 14.61,15.11 v1(14.57,15.08) 14.57,12.92 13.97,12.32 6.73,12.32 5.72,13.33 5.72,18.16 3.94,19.94 3.94,37.85 10.97,44.88 U97.4 ; v1(14.61,18.53) v1(12.95,18.53) ; v1(53.47,20.32) 54.99,20.32 v1(55.5,19.81)
  Top Layer w0.305: U29.5 64.52,17.78 v1(64.26,18.03) ; v1(57.02,17.91) 57.15,17.78 U27.5 ; v1(78.9,14.69) 78.9,8.96 R263.1 ; U23.5 60.83,17.78 v1(60.71,17.91)
  Inner2 w0.203: v1(21.59,18.35) 51.5,18.35 v1(53.47,20.32) ; v1(55.5,19.81) 57.02,18.29 v1(57.02,17.91)
  Bottom Layer w0.203: C465.1 20.07,18.35 v1(21.59,18.35)
  Bottom Layer w0.305: v1(60.71,17.91) 61.16,17.91 61.47,17.6 61.47,16.38 ; 78.81,18.25 78.85,18.29 79.88,18.29 80.14,18.03 80.14,16.97 79.94,16.77 U100.7 ; U112.5 80.52,10.79 80.9,11.18 80.9,14.69 ; 80.9,14.69 80.9,18.8 80.2,19.5 76.77,19.5 76.07,20.19 76.07,21.59 75.69,21.97 70.87,21.97 68.45,24.38 68.45,25.35 L14.1 ; 80.9,14.69 v1(78.9,14.69) 78.81,14.6 67.56,14.6 65.79,16.38 64.69,16.38 ; 61.47,16.38 59.05,16.38 57.53,17.91 v1(57.02,17.91) ; 61.47,16.38 64.69,16.38 ; v1(64.26,18.03) 64.44,18.03 65.02,17.45 65.02,16.71 64.69,16.38
  Bottom Layer w0.381: U103.5 74.22,25.53 L14.1 ; U100.10 78.71,18.35 C24.1 80.71,20.7 80.71,20.7
VCC5V: length 158.6
  Top Layer w0.152: v1(85.6,43.62) 85.6,42.68 85.57,42.66
  Top Layer w0.254: L12.1 8.61,17.53 v1(6.86,17.53)
  Top Layer w0.305: v2(65.66,12) 68.07,12 C494.1
  Top Layer w0.381: 72.4,16.57 C495.1 ; 72.4,16.57 72.14,16.31 72.14,14.82 ; 72.4,16.57 74.2,16.57 U109.5 ; 72.4,16.57 U110.8 U110.7 ; 84.58,42.66 84.58,38.73 85.46,37.86 USB4.2 ; 84.58,42.66 81.9,42.66 80.37,41.13 v2(80.37,33.08) ; 84.58,42.66 USB4.11 ; 72.14,14.82 75.82,14.82 ; 72.14,14.82 68.33,14.82 ; 75.82,14.82 77.43,14.82 78.49,15.87 v2(78.49,22.25) ; 75.82,14.82 75.82,16.49 75.75,16.56 ; U109.7 75.75,16.56 ; 75.75,16.56 U109.8 ; U110.5 68.33,14.82 ; 68.33,14.82 68.33,8.63 R255.2 68.83,7.88 U108.5
  Bottom Layer w0.152: D59.2 v1(85.6,43.62)
  Bottom Layer w0.254: v1(6.86,17.53) 6.86,13.21 8.51,11.56 24,11.56 25.4,12.95 30.35,12.95 31.5,14.1 42.67,14.1 43.05,14.48 44.32,14.48 45.08,13.72 59.31,13.72 60.21,12.82 U104.1
  Bottom Layer w0.305: v2(65.66,12) C481.2 63.76,12.13 U104.1 59.37,12.13 59.18,11.94 59.18,10.54 59.5,10.23 U104.3
  Bottom Layer w0.381: v2(80.37,33.08) 80.39,33.07 C501.2 80.27,31.94 U111.1 75.92,31.94 75.6,31.62 75.6,30.06 ; 75.6,30.06 75.6,25.08 ; 75.6,30.06 75.63,30.04 U111.3 ; C485.2 C478.2 ; C485.2 78.11,23.56 U103.3 75.98,23.56 75.6,23.94 75.6,25.08 ; C485.2 v2(78.49,22.25) ; 75.6,25.08 75.98,25.46 U103.1
VDD: length 191.1
  Top Layer w0.203: v1(52.83,15.37) 52.83,16.36 R59.1 ; U99.114 29.31,29.75 v1(28.96,30.1) ; v1(34.16,39.75) 34.16,41.22 34.14,41.25 ; U99.62 45.3,45.94 46.23,46.86 v1(47.45,46.86) 51.8,46.86 ; U99.6 57.02,23.25 57.02,23.24 ; 57.02,23.24 57.02,20.62 54.23,17.82 54.23,16.89 53.72,16.38 R59.1 ; 57.02,23.24 57.02,27.69 ; U99.127 28.07,23.25 24.01,27.3 v1(24,27.3) ; R59.1 52.69,16.38 51.8,17.27 U99.172 ; 35.31,41.25 35.31,44.04 U99.82 v1(35.3,47.62) ; 35.31,41.25 35.31,40.26 35.94,39.62 39.37,39.62 39.81,40.06 39.81,42.73 40.3,43.22 U99.72 ; 35.31,41.25 34.14,41.25 ; U99.136 v1(33.8,15.87) ; 51.8,46.86 59.56,46.86 62.36,44.07 v1(62.36,43.43) ; 51.8,46.86 U99.49 ; 57.02,27.69 v1(57.02,28.45) ; 57.02,27.69 56.96,27.75 U99.15 ; U99.103 30.51,35.24 v1(31.62,35.24) ; 34.14,41.25 U99.91 ; v1(57.02,38.23) 57,38.25 U99.36 ; U99.23 v1(57.02,31.75) ; v1(44.7,15.37) 44.7,16.89 45.3,17.49 U99.159 ; U99.149 v1(40.3,15.87)
  Inner2 w0.203: v1(65.79,42.93) 62.86,42.93 v1(62.36,43.43) ; v1(33.8,15.87) 34.31,15.37 39.8,15.37 v1(40.3,15.87) ; v1(34.16,39.75) 31.62,37.2 v1(31.62,35.24) 30.16,35.24 28.96,34.04 v1(28.96,30.1) ; v1(57.02,38.23) 57.02,39.12 56.26,39.88 56.26,41.4 50.78,46.88 47.47,46.88 v1(47.45,46.86) 47.45,47.41 46.99,47.88 35.56,47.88 v1(35.3,47.62)
  Bottom Layer w0.203: v1(57.02,28.45) v1(57.02,31.75) 56.13,32.63 56.13,36.7 57.02,37.59 v1(57.02,38.23) ; v1(52.83,15.37) 52.45,15.75 45.08,15.75 v1(44.7,15.37) 40.81,15.37 v1(40.3,15.87) ; v1(24,27.3) 24,28.45 25.65,30.1 v1(28.96,30.1) ; v1(65.79,42.93) C458.2
  Bottom Layer w0.381: C458.2 C459.2 C455.2 C460.2 C461.2 C456.2 C457.2 C454.2 C462.2 66.44,25.62 L14.2
VDD_SDRAM: length 87.3
  Top Layer w0.254: v1(41.4,34.29) 33.53,34.29 33.13,34.69 v1(33.13,35.58) ; v1(53.47,35.69) 51.18,33.4 45.5,33.4 43.39,35.51 v1(43.31,35.51)
  Inner2 w0.254: v1(43.31,35.51) 43.31,33.53 43.94,32.89 43.94,28.57 43.18,27.81 v1(41.45,27.81) ; v1(53.47,35.69) v1(53.47,40.26)
  Bottom Layer w0.203: v2(60.39,41.9) 60.39,42.86 59.44,43.81 R56.2
  Bottom Layer w0.254: U98.1 32.65,35.93 33,35.58 v1(33.13,35.58) 33.93,35.58 34.25,35.9 U98.3 34.25,38.14 34.04,38.35 34.04,39.12 ; v1(41.4,34.29) 41.4,35.5 41.41,35.51 ; U98.9 39.05,35.88 39.42,35.51 41.41,35.51 ; 41.45,25.85 41.45,24.67 41.27,24.49 36.83,24.49 36.65,24.67 U98.49 ; 43,35.51 43.05,35.56 U98.14 ; 43,35.51 v1(43.31,35.51) ; 43,35.51 41.41,35.51 ; R56.2 57.4,43.81 55.63,42.04 55.63,41.66 54.23,40.26 v1(53.47,40.26) ; v1(53.47,35.69) 53.47,37.12 U98.27 ; U98.43 v1(41.45,27.81)
  Bottom Layer w0.381: v2(60.39,41.9) 60.95,41.34 C438.1 C437.1 C436.1 C435.1 C434.1 C433.1 C432.1 C431.1
VDDA: length 92.8
  Top Layer w0.203: U8.15 U8.14 41.04,7.81 v1(44.01,7.81) ; U8.6 38.55,5.71 v1(38.1,5.71) ; U99.39 55.61,39.74 57.65,39.74 58.02,40.12 58.02,40.44 58.23,40.64 ; L2.2 54.86,11.71 54.47,12.11 50.27,12.11 v1(50.23,12.06) 50.23,10.5 U7.16 ; L11.2 v1(59.18,40.39) ; U8.1 v1(37.87,8.51)
  Inner2 w0.203: v1(59.94,25.15) 60.58,24.51 60.58,21.21 59.94,20.57 55.5,20.57 54.72,19.8 54.72,16.53 55.37,15.87 57.02,15.87 57.91,14.99 v1(57.91,12.83)
  Bottom Layer w0.203: R54.1 35.06,12.95 35.31,12.7 35.31,9.65 35.62,9.34 C7.1 ; v1(37.87,8.51) 37.87,8.8 C7.1 ; v1(59.94,25.15) 59.94,40 59.56,40.39 v1(59.18,40.39) ; 44.07,10.03 47.75,10.03 48.38,10.66 R16.2 49.85,12.45 v1(50.23,12.06) 54.17,12.06 C483.2 ; 44.07,10.03 44.01,9.97 v1(44.01,7.81) ; 44.07,10.03 43.05,10.03 41.64,11.45 40.15,11.45 38.04,9.34 C7.1 ; v1(57.91,12.83) 57.91,12.14 U104.5 ; C7.1 C18.2 37.78,5.71 v1(38.1,5.71)
  Bottom Layer w0.305: U104.5 54.35,12.13 C483.2
(no net):
  vias: v1(0.64,52.96) v1(0.64,2.67) v1(1.14,54.43) v1(1.14,51.43) v1(1.14,4.14) v1(1.14,1.14) v1(2.67,54.99) v1(2.67,50.93) v1(2.67,4.7) v1(2.67,0.63) v1(4.19,54.48) v1(4.14,51.43) v1(4.19,4.19) v1(4.14,1.14) v1(4.7,52.96) v1(4.7,2.67) v1(90.3,52.96) v1(90.3,2.67) v1(90.8,54.43) v1(90.8,51.43) v1(90.8,4.14) v1(90.8,1.14) v1(92.33,54.99) v1(92.33,50.93) v1(92.33,4.7) v1(92.33,0.63) v1(93.8,51.43) v1(93.8,1.14) v1(93.85,54.48) v1(93.85,4.19) v1(94.36,52.96) v1(94.36,2.67)
3.5L: length 19.1
  Top Layer w0.203: v1(41.34,12.95) 41.34,12.06 41.39,12.01 v1(41.39,10.25)
  Inner2 w0.203: v1(41.34,12.95) 35.81,12.95 33.16,10.3 v1(33.16,7.53)
  Bottom Layer w0.203: D51.1 30.75,7.84 R52.2 33.04,7.65 v1(33.16,7.53)
3.5R: length 29.6
  Top Layer w0.203: v1(42.55,2.29) 41.56,2.29 C19.2 41.52,2.44 v1(41.52,4.32)
  Inner2 w0.203: v1(26.16,11.33) 26.16,9.52 34.29,1.4 41.66,1.4 v1(42.55,2.29)
  Bottom Layer w0.203: D52.1 27.55,11.33 v1(26.16,11.33) 26.16,8.97 R53.2
BL_CTR: length 24.9
  Top Layer w0.152: v1(20.3,35.92) 20.25,35.96 FPC2.7 ; U99.100 v1(29.08,36.75)
  Inner2 w0.152: v1(29.08,36.75) 29.08,36.45 28.4,35.76 20.45,35.76 v1(20.3,35.92)
BOOT0: length 34.9
  Top Layer w0.152: U99.166 48.8,16.59 R9.2 50.66,14.73 52.96,14.73 55.28,17.06 v1(55.28,17.14)
  Inner2 w0.152: v1(55.28,17.14) 56.34,17.14 56.82,16.66 64.54,16.66 65.02,17.14 76.07,17.14 v1(76.9,16.32)
  Bottom Layer w0.152: U100.6 76.95,16.27 v1(76.9,16.32)
CH340_D+: length 9.8
  Top Layer w0.152: v1(88.65,18.28) USB3.8 87.01,18.28 86.86,18.12 86.86,17.43 87.01,17.28 USB3.6
  Bottom Layer w0.152: D55.2 89.35,18.28 v1(88.65,18.28) 88.64,18.27 U100.1
CH340_D-: length 9.9
  Top Layer w0.152: USB3.7 88.27,17.78 88.65,17.4 v1(88.65,16.78) USB3.5
  Bottom Layer w0.152: D54.2 89.33,16.78 v1(88.65,16.78) 88.65,17.4 88.27,17.77 U100.2
CHG: length 64.7
  Top Layer w0.152: U105.9 81.35,8.15 81.15,8.34 R263.2 79.79,10.17 ; v1(75.57,38.23) 75.57,26.8 79.79,22.57 79.79,11.47 ; v1(80.17,10.14) 80.14,10.17 79.79,10.17 ; 79.79,10.17 79.79,11.47 ; CHG.2 79.81,11.48 79.79,11.47 ; U99.47 52.8,45.06 53.09,45.34 v1(58.8,45.34)
  Inner2 w0.152: v1(58.8,45.34) 61.98,45.34 63.12,46.48 68.2,46.48 75.57,39.12 v1(75.57,38.23)
  Bottom Layer w0.381: v1(80.17,10.14) U112.6
CTP_INT: length 35.9
  Top Layer w0.152: v1(24.13,39.37) 24.13,43.69 27.31,46.86 32.77,46.86 34.3,45.33 U99.84 ; v1(23.24,38.48) 23.22,38.46 FPC2.2
  Bottom Layer w0.152: v1(23.24,38.48) 24.13,39.37 v1(24.13,39.37)
CTP_RST: length 24.3
  Top Layer w0.152: U99.101 28.14,36.25 v1(28.07,36.32) ; FPC2.6 v1(19.81,36.46)
  Bottom Layer w0.152: v1(19.81,36.46) 27.93,36.46 v1(28.07,36.32)
CTP_SCL: length 27.8
  Top Layer w0.152: FPC2.3 19.83,37.96 28.58,29.21 30.47,29.21 U99.115
CTP_SDA: length 27.6
  Top Layer w0.152: FPC2.5 20.19,36.96 28.4,28.75 U99.116
DAC_L: length 27.1
  Top Layer w0.203: U8.19 38.97,9.66 R2.1 38.35,12.01 38.29,12.06 38.29,13.15 v1(38.61,13.46)
  Top Layer w0.254: U7.13 v1(52.58,8.74)
  Inner2 w0.203: v1(52.58,8.74) 52.58,12.7 48.64,16.64 41.78,16.64 v1(38.61,13.46)
DAC_LB: length 22.2
  Top Layer w0.203: v1(40.39,13.46) 40.39,13.33 39.94,12.89 C15.2 39.89,12.01 R7.2 39.37,9.74 U8.18
  Top Layer w0.254: U7.14 v1(51.47,10.03)
  Inner2 w0.203: v1(51.47,10.03) 51.47,12.92 48.39,16 43.52,16 43.01,15.49 42.42,15.49 v1(40.39,13.46)
DAC_OSC: length 2.7
  Top Layer w0.254: 53.15,5.24 53.15,5.24 U7.7
DAC_P1: length 12.3
  Top Layer w0.152: U99.162 46.8,17.47 46.23,16.89 v1(46.23,14.99) ; v1(45.47,8.25) 45.48,8.24 U7.24
  Inner2 w0.152: v1(45.47,8.25) 45.97,8.76 45.97,14.73 v1(46.23,14.99)
DAC_P2: length 11.6
  Top Layer w0.152: U99.161 46.3,17.73 45.47,16.89 v1(45.47,14.99) ; v1(45.34,9.12) 45.34,9.02 45.62,8.74 U7.23
  Inner2 w0.152: v1(45.47,14.99) 45.47,9.25 v1(45.34,9.12)
DAC_R: length 25.1
  Top Layer w0.203: v1(39.24,2.41) C16.2 38.35,2.47 R8.2 38.97,4.94 U8.7
  Top Layer w0.254: v1(53.97,7.24) 52.7,7.24 52.34,6.88 52.34,6.88 52.19,6.74 U7.9
  Bottom Layer w0.203: v1(39.24,2.41) 40.26,1.4 48.51,1.4 53.97,6.85 v1(53.97,7.24)
DAC_RB: length 22.2
  Top Layer w0.203: U8.8 39.37,4.96 R10.1 40.01,2.43 C19.1 40.07,1.73 40.27,1.52 45.97,1.52 v1(46.48,2.03)
  Top Layer w0.254: U7.10 52.2,7.24 52.58,7.62 v1(52.58,8)
  Bottom Layer w0.203: v1(52.58,8) 52.58,6.35 49.53,3.3 47.75,3.3 v1(46.48,2.03)
FMC_A0: length 20.8
  Top Layer w0.152: v3(52.07,28.32) 52.14,28.25 U99.16
  Bottom Layer w0.152: v3(52.07,28.32) 50.25,30.14 50.25,31.59 arc(50.2,31.73) 50.06,31.78 49.51,31.78 arc(49.32,31.97) 49.51,32.17 50.06,32.17 arc(50.25,32.36) 50.06,32.55 49.51,32.55 arc(49.32,32.74) 49.51,32.93 50.06,32.93 arc(50.25,33.12) 50.06,33.31 49.51,33.31 arc(49.32,33.5) 49.51,33.69 50.06,33.69 arc(50.25,33.88) 50.06,34.07 49.51,34.07 arc(49.32,34.26) 49.51,34.45 50.06,34.45 arc(50.25,34.64) 50.06,34.83 49.51,34.83 arc(49.32,35.02) 49.51,35.21 50.06,35.21 arc(50.2,35.27) 50.25,35.4 U98.23
FMC_A1: length 20.9
  Top Layer w0.152: U99.17 52.79,28.75 v3(52.7,28.83)
  Bottom Layer w0.152: v3(52.7,28.83) 52.32,28.83 51.05,30.1 51.05,31.18 arc(51.11,31.31) 51.24,31.37 51.75,31.37 arc(51.94,31.56) 51.75,31.75 51.24,31.75 arc(51.05,31.94) 51.24,32.13 51.75,32.13 arc(51.94,32.32) 51.75,32.51 51.24,32.51 arc(51.05,32.7) 51.24,32.89 51.75,32.89 arc(51.94,33.08) 51.75,33.27 51.24,33.27 arc(51.05,33.46) 51.24,33.65 51.75,33.65 arc(51.94,33.84) 51.75,34.03 51.24,34.03 arc(51.05,34.22) 51.24,34.42 51.75,34.42 arc(51.94,34.61) 51.75,34.8 51.24,34.8 arc(51.05,34.99) 51.24,35.18 51.75,35.18 arc(51.94,35.37) 51.75,35.56 51.24,35.56 arc(51.11,35.61) 51.05,35.75 U98.24
FMC_A2: length 20.9
  Top Layer w0.152: U99.18 57.44,29.25 v3(57.53,29.34)
  Bottom Layer w0.152: v3(57.53,29.34) 57.53,36.92 arc(57.59,37.06) 57.72,37.11 58.52,37.11 arc(58.71,37.3) 58.52,37.49 57.72,37.49 arc(57.59,37.55) 57.53,37.68 57.53,38.48 56.9,39.12 52.2,39.12 51.85,38.77 U98.25
FMC_A3: length 21
  Top Layer w0.152: v3(52.65,30.23) 52.65,30.15 53.06,29.75 U99.19
  Bottom Layer w0.152: v3(52.65,30.23) 52.65,30.71 arc(52.71,30.84) 52.84,30.9 53.53,30.9 arc(53.72,31.09) 53.53,31.28 52.84,31.28 arc(52.65,31.47) 52.84,31.66 53.53,31.66 arc(53.72,31.85) 53.53,32.04 52.84,32.04 arc(52.65,32.23) 52.84,32.42 53.53,32.42 arc(53.72,32.61) 53.53,32.8 52.84,32.8 arc(52.65,32.99) 52.84,33.18 53.53,33.18 arc(53.72,33.37) 53.53,33.56 52.84,33.56 arc(52.65,33.75) 52.84,33.94 53.53,33.94 arc(53.72,34.13) 53.53,34.33 52.84,34.33 arc(52.65,34.52) 52.84,34.71 53.53,34.71 arc(53.72,34.9) 53.53,35.09 52.84,35.09 arc(52.71,35.14) 52.65,35.28 U98.26
FMC_A4: length 20.8
  Top Layer w0.152: v3(58.17,30.26) 58.15,30.25 U99.20
  Bottom Layer w0.152: U98.29 52.65,24.56 53.34,23.88 57.4,23.88 58.29,24.76 58.29,25.3 arc(58.24,25.44) 58.1,25.49 57.47,25.49 arc(57.28,25.69) 57.47,25.88 58.1,25.88 arc(58.29,26.07) 58.1,26.26 57.47,26.26 arc(57.28,26.45) 57.47,26.64 58.1,26.64 arc(58.29,26.83) 58.1,27.02 57.47,27.02 arc(57.28,27.21) 57.47,27.4 58.1,27.4 arc(58.24,27.46) 58.29,27.59 58.29,30.14 v3(58.17,30.26)
FMC_A5: length 20.9
  Top Layer w0.152: v3(59.31,30.48) 59.04,30.75 U99.21
  Bottom Layer w0.152: U98.30 51.85,24.22 52.83,23.24 57.91,23.24 59.31,24.64 59.31,26.73 arc(59.35,26.82) 59.44,26.85 arc(59.53,26.89) 59.56,26.98 59.56,27.11 arc(59.53,27.2) 59.44,27.23 arc(59.35,27.27) 59.31,27.36 59.31,27.49 arc(59.35,27.58) 59.44,27.61 arc(59.53,27.65) 59.56,27.74 59.56,27.87 arc(59.53,27.96) 59.44,28 arc(59.35,28.03) 59.31,28.12 59.31,28.25 arc(59.35,28.34) 59.44,28.38 arc(59.53,28.41) 59.56,28.5 59.56,28.63 arc(59.53,28.72) 59.44,28.76 arc(59.35,28.79) 59.31,28.88 59.31,29.01 arc(59.35,29.1) 59.44,29.14 arc(59.53,29.18) 59.56,29.27 59.56,29.39 arc(59.53,29.48) 59.44,29.52 arc(59.35,29.56) 59.31,29.65 v3(59.31,30.48)
FMC_A6: length 20.8
  Top Layer w0.152: v3(46.23,42.29) 46.3,42.37 U99.60
  Inner2 w0.152: v3(48.26,32.64) 48.26,40.26 v3(46.23,42.29)
  Bottom Layer w0.152: U98.31 51.05,28.19 49.07,30.17 arc(49.02,30.31) 49.07,30.44 49.12,30.49 arc(49.12,30.76) 48.85,30.76 48.8,30.71 arc(48.67,30.66) 48.53,30.71 48.26,30.99 v3(48.26,32.64)
FMC_A7: length 20.9
  Top Layer w0.152: U99.63 44.8,42.95 v3(45.47,42.29)
  Inner2 w0.152: v3(45.47,42.29) 45.95,41.81 arc(46,41.68) 45.95,41.56 arc(45.89,41.43) 45.95,41.3 45.96,41.29 arc(46.09,41.23) 46.22,41.29 arc(46.34,41.34) 46.47,41.29 47.65,40.11 v3(47.65,31.37)
  Bottom Layer w0.152: v3(47.65,31.37) 47.63,31.34 47.63,30.63 50.25,28 U98.32
